# EAGLE board joyre_v1_1 (EAGLE 9.3.1), part 1 of 2
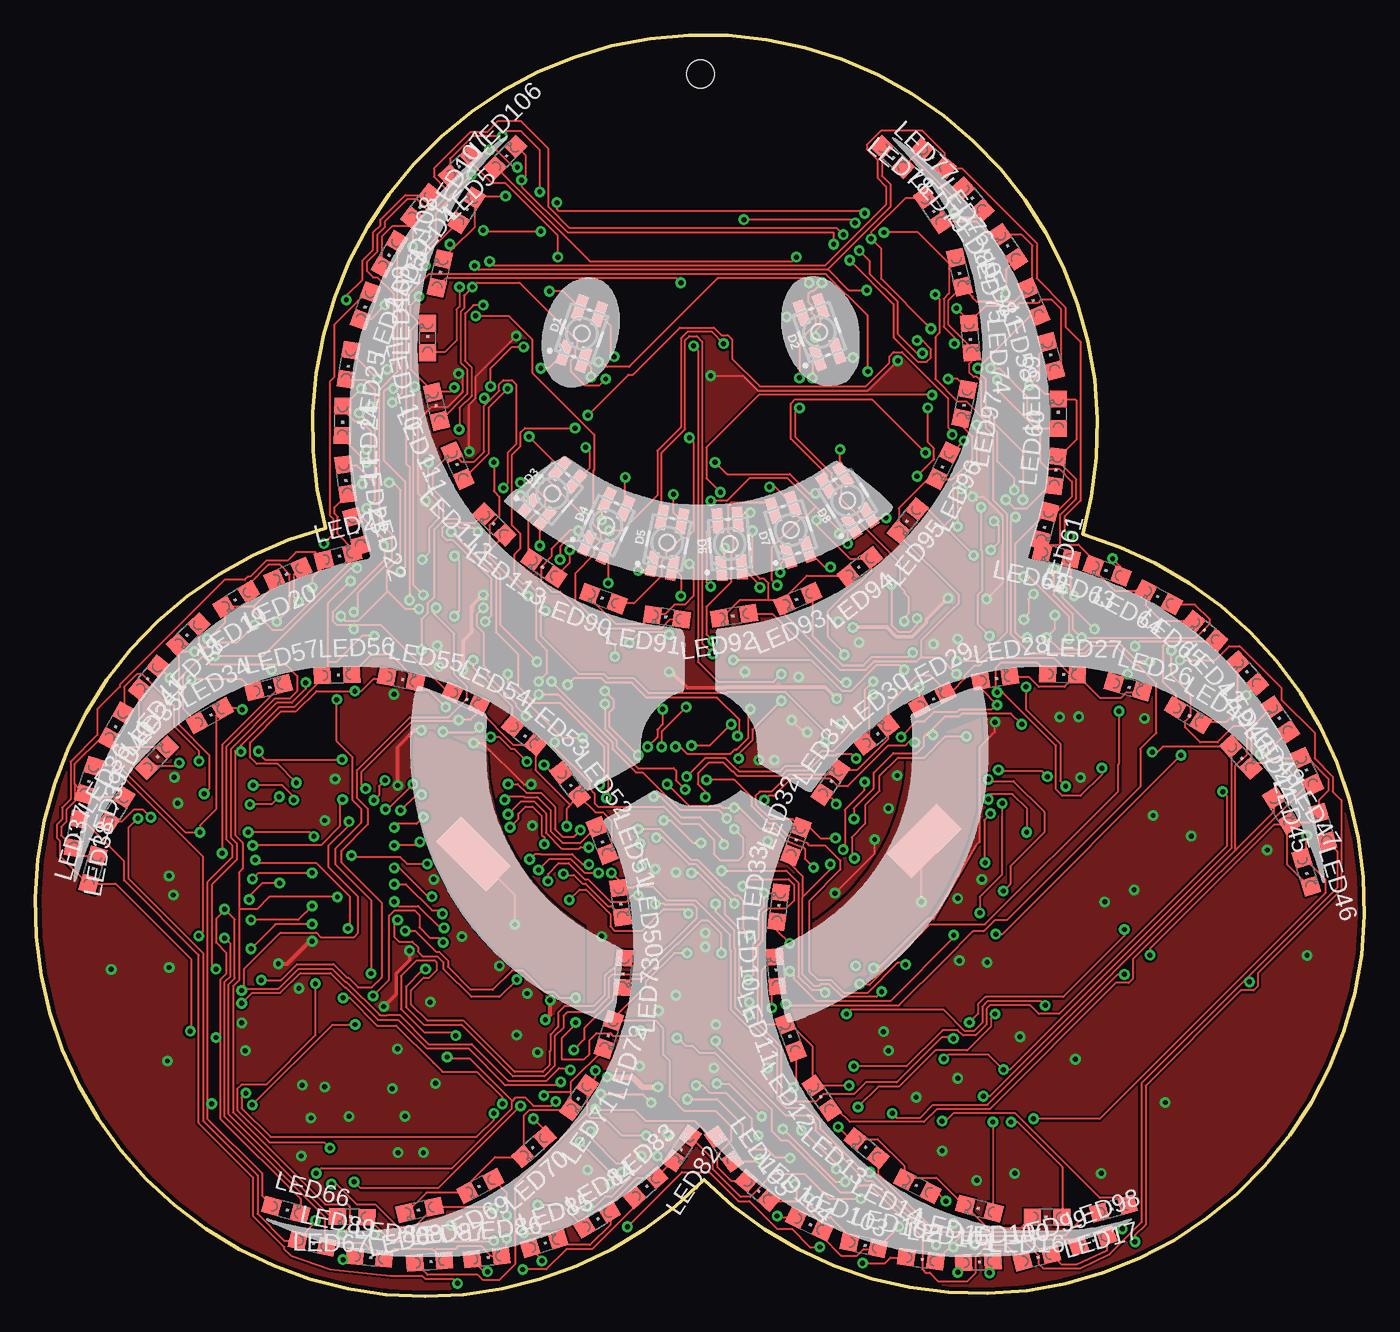
[diagram p1: board, top side]
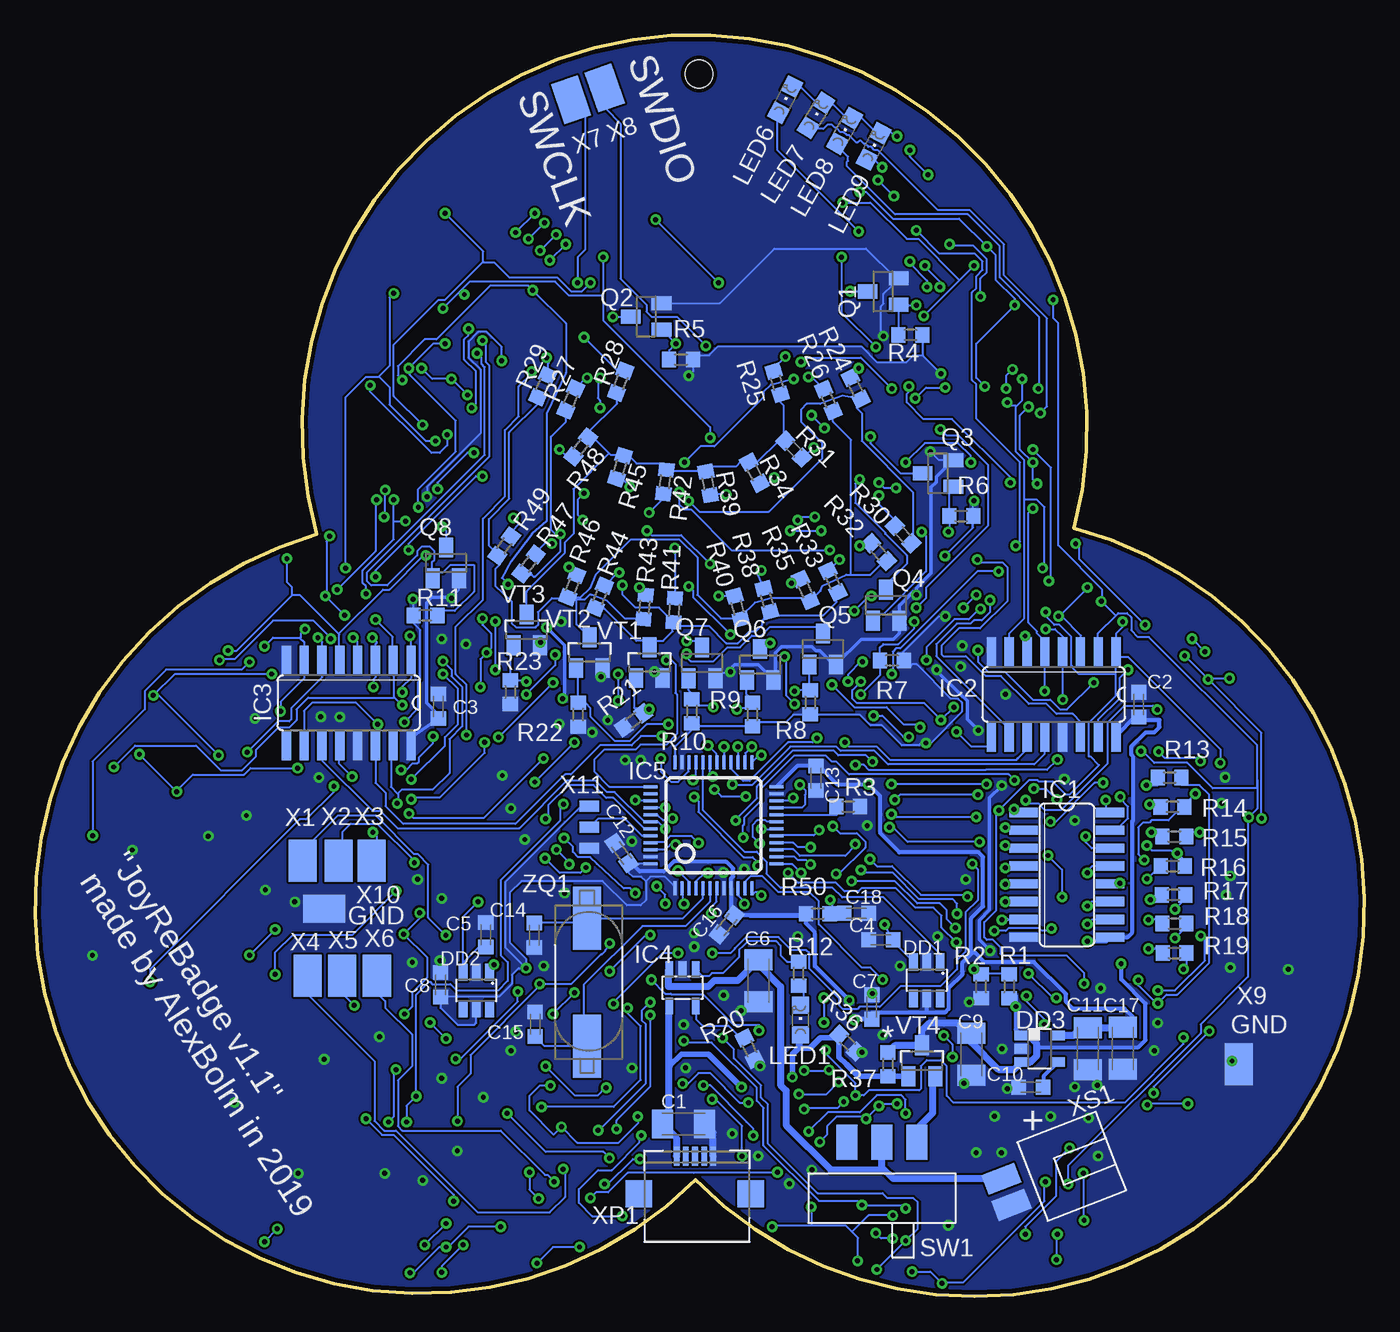
[diagram p2: board, bottom side, seen from below]

Size 94.79 x 89.91 mm. Coordinates in mm from the lower left corner, seen from the top.
Outline: 74.7,54.31 arc211 20.71,54.77 arc211 47.7,8.31 arc209 74.7,54.31
Copper layers (1*16): Top 0.035mm / dielectric 1.5mm / Bottom 0.035mm
Design rules "default *": minimum track width 6mil, minimum drill 0.35mm, track to track 6mil, track to pad 6mil, pad to pad 6mil, via to via 6mil, smd to smd 0mil, copper to edge 0.3mm, drill to drill 6mil, minimum pad ring 10mil, minimum via ring 8mil, stop-mask expansion 4mil, vias tented up to drill 15mil, thermal gap 10mil
Holes 2 mm at 47.45,87.14

## Footprints (pad centres in the part's own frame; a part is rotated, then mirrored left to right if it is on the bottom)
C1206K = smd 1.5 x 2: 1 -1.5,0; 2 1.5,0
C0603K = smd 1.05 x 1.08: 1 -0.875,0; 2 0.875,0
P-LCC-4-3 = smd 1.8 x 0.75: 1 -1.7,0.725; 2 -1.7,-0.725; 3 1.7,-0.725; 4 1.7,0.725
TSOT23-6 = smd 0.62 x 1.22: 1 -0.95,-1.3; 2 0,-1.3; 3 0.95,-1.3; 4 0.95,1.3; 5 0,1.3; 6 -0.95,1.3
DBV_R-PDSO-G5 = smd 0.69 x 0.99: 1 -0.95,-1.29; 2 0,-1.29; 3 0.95,-1.29; 4 0.95,1.3; 5 -0.95,1.3
SO16 = smd 0.66 x 2.032: 1 -4.445,-3.073; 2 -3.175,-3.073; 3 -1.905,-3.073; 4 -0.635,-3.073; 5 0.635,-3.073; 6 1.905,-3.073; 7 3.175,-3.073; 8 4.445,-3.073; 9 4.445,3.073; 10 3.175,3.073; 11 1.905,3.073; 12 0.635,3.073; 13 -0.635,3.073; 14 -1.905,3.073; 15 -3.175,3.073; 16 -4.445,3.073
SOT23-5L = smd 0.55 x 1.2: 1 -0.95,-1.3; 2 0,-1.3; 3 0.95,-1.3; 4 0.95,1.3; 5 -0.95,1.3
TQFP48 = smd 0.2 x 1: 1 -2.75,-4.5; 2 -2.25,-4.5; 3 -1.75,-4.5; 4 -1.25,-4.5; 5 -0.75,-4.5; 6 -0.25,-4.5; 7 0.25,-4.5; 8 0.75,-4.5; 9 1.25,-4.5; 10 1.75,-4.5; 11 2.25,-4.5; 12 2.75,-4.5; 25 2.75,4.5; 26 2.25,4.5; 27 1.75,4.5; 28 1.25,4.5; 29 0.75,4.5; 30 0.25,4.5; 31 -0.25,4.5; 32 -0.75,4.5; 33 -1.25,4.5; 34 -1.75,4.5; 35 -2.25,4.5; 36 -2.75,4.5 | smd 1 x 0.2: 13 4.5,-2.75; 14 4.5,-2.25; 15 4.5,-1.75; 16 4.5,-1.25; 17 4.5,-0.75; 18 4.5,-0.25; 19 4.5,0.25; 20 4.5,0.75; 21 4.5,1.25; 22 4.5,1.75; 23 4.5,2.25; 24 4.5,2.75; 37 -4.5,2.75; 38 -4.5,2.25; 39 -4.5,1.75; 40 -4.5,1.25; 41 -4.5,0.75; 42 -4.5,0.25; 43 -4.5,-0.25; 44 -4.5,-0.75; 45 -4.5,-1.25; 46 -4.5,-1.75; 47 -4.5,-2.25; 48 -4.5,-2.75
CHIPLED_0805 = smd 1.2 x 1.2: A 0,-1.05; C 0,1.05
SOT23 = smd 1 x 1.4: 1 -0.95,-1.1; 2 0.95,-1.1; 3 0,1.1
R0603 = smd 1 x 1.1: 1 -0.85,0; 2 0.85,0
SS12D00G3 = smd 1.5 x 2.5: 1 0,-1.25; 2 2.5,-1.25; 3 5,-1.25
1PIN_SMD_3X2 = smd 2 x 3: P$1 0,0
3PIN_SOLDER = smd 0.8 x 1.4: 1 0,0; 2 1.5,0; 3 3,0
CAP_PIN = smd 5 x 2.5: P$1 0,0
USB_MICR_SMD = smd 0.4 x 1.35: P$1 0,0; P$2 0.65,0; P$3 1.3,0; P$4 1.95,0; P$5 2.6,0 | smd 1.9 x 1.9: P$6 -2.715,-2.67; P$7 5.285,-2.67
CWF-2R = smd 1.5 x 2.5: P$1 0,-2; P$2 2,-2
HC49SM = smd 4.5 x 2: 1 0,0; 2 9.1,0

## Placement (x,y rotation side)
C1  10u  [C1206K]  48.55,12.3 0 bottom
C2  0.1u  [C0603K]  16.1,42.19 90 bottom
C3  0.1u  [C0603K]  66.03,42.07 90 bottom
C4  [C0603K]  34.47,25.42 0 bottom
C5  [C0603K]  62.65,25.79 270 bottom
C6  10u  [C1206K]  43.2,22.51 270 bottom
C7  0.1u  [C0603K]  35.13,20.64 270 bottom
C8  0.1u  [C0603K]  65.88,22.22 270 bottom
C9  10u  [C1206K]  28.03,17.26 270 bottom
C10  0.1u  [C0603K]  23.79,14.91 180 bottom
C11  10u  [C1206K]  19.73,17.67 270 bottom
C12  0.1u  [C0603K]  52.97,31.61 125 bottom
C13  0.1u  [C0603K]  39.1,36.94 270 bottom
C14  22p  [C0603K]  59.19,25.75 270 bottom
C15  22p  [C0603K]  59.13,19.4 90 bottom
C16  0.1u  [C0603K]  45.48,26.51 231 bottom
C17  10u  [C1206K]  17.23,17.68 270 bottom
C18  0.1u  [C0603K]  36.22,27.32 0 bottom
D1  RGB  [P-LCC-4-3]  38.98,68.64 71 top
D2  RGB  [P-LCC-4-3]  55.93,68.74 109.8 top
D3  RGB  [P-LCC-4-3]  36.88,57.24 50.2 top
D4  RGB  [P-LCC-4-3]  40.73,54.94 65.1 top
D5  RGB  [P-LCC-4-3]  45.08,53.74 78.5 top
D6  RGB  [P-LCC-4-3]  49.53,53.64 94.4 top
D7  RGB  [P-LCC-4-3]  53.88,54.64 108 top
D8  RGB  [P-LCC-4-3]  57.93,56.74 122.4 top
DD1  TTP223-BA6  [TSOT23-6]  31.21,22.54 180 bottom
DD2  TTP223-BA6  [TSOT23-6]  63.33,21.82 180 bottom
DD3  TPS79333  [DBV_R-PDSO-G5]  23.16,17.66 270 bottom
IC1  ULN2003AD  [SO16]  21.22,30.05 270 bottom
IC2  74HC595D  [SO16]  22.16,42.91 180 bottom
IC3  74HC595D  [SO16]  72.43,42.31 180 bottom
IC4  MCP73831/OT  [SOT23-5L]  48.62,22 180 bottom
IC5  STM32F10XCXT6  [TQFP48]  46.42,33.59 0 bottom
LED1  [CHIPLED_0805]  40.21,19.72 0 bottom
LED2  [CHIPLED_0805]  23.57,70.61 160.2 top
LED3  [CHIPLED_0805]  25.29,74.31 150 top
LED4  [CHIPLED_0805]  27.51,77.71 141.7 top
LED5  [CHIPLED_0805]  30.33,80.61 133.7 top
LED6  [CHIPLED_0805]  41.3,85.31 332.8 bottom
LED7  [CHIPLED_0805]  39.1,84.2 327.9 bottom
LED8  [CHIPLED_0805]  37.07,83.09 330.3 bottom
LED9  [CHIPLED_0805]  34.99,81.98 332.9 bottom
LED10  [CHIPLED_0805]  52.85,23.16 4.6 top
LED11  [CHIPLED_0805]  53.87,18.46 21.2 top
LED12  [CHIPLED_0805]  56.09,14.16 34.8 top
LED13  [CHIPLED_0805]  59.31,10.56 50.9 top
LED14  [CHIPLED_0805]  62.93,7.86 63.3 top
LED15  [CHIPLED_0805]  67.35,6.26 75.4 top
LED16  [CHIPLED_0805]  72.17,5.66 89.8 top
LED17  [CHIPLED_0805]  76.89,6.26 105.5 top
LED18  [CHIPLED_0805]  10.93,47.2 133.6 top
LED19  [CHIPLED_0805]  14.35,49.7 121.3 top
LED20  [CHIPLED_0805]  18.03,51.52 113.8 top
LED21  [CHIPLED_0805]  21.61,52.75 284.2 top
LED22  [CHIPLED_0805]  22.93,54.55 196.3 top
LED23  [CHIPLED_0805]  22.15,58.25 187.9 top
LED24  [CHIPLED_0805]  21.93,62.41 179.2 top
LED25  [CHIPLED_0805]  22.35,66.41 170.7 top
LED26  [CHIPLED_0805]  77.93,43.44 253.5 top
LED27  [CHIPLED_0805]  73.25,44.34 268.2 top
LED28  [CHIPLED_0805]  68.47,44.04 279.2 top
LED29  [CHIPLED_0805]  63.99,42.54 298.4 top
LED30  [CHIPLED_0805]  60.01,40.04 308.1 top
LED31  [CHIPLED_0805]  56.73,36.64 325.5 top
LED32  [CHIPLED_0805]  54.25,32.44 339.3 top
LED33  [CHIPLED_0805]  53.03,27.76 352.7 top
LED34  [CHIPLED_0805]  12.47,41.4 299.3 top
LED35  [CHIPLED_0805]  8.69,38.4 315.8 top
LED36  [CHIPLED_0805]  5.81,34.7 328.2 top
LED37  [CHIPLED_0805]  4.13,30.4 343.7 top
LED38  [CHIPLED_0805]  2.95,33 169.5 top
LED39  [CHIPLED_0805]  3.87,36.8 161.6 top
LED40  [CHIPLED_0805]  5.79,40.7 150.6 top
LED41  [CHIPLED_0805]  8.11,44.1 141.6 top
LED42  [CHIPLED_0805]  86.47,44.44 42 top
LED43  [CHIPLED_0805]  88.79,41.14 33.6 top
LED44  [CHIPLED_0805]  90.71,37.44 24.6 top
LED45  [CHIPLED_0805]  91.83,33.44 16.3 top
LED46  [CHIPLED_0805]  90.65,30.24 197.8 top
LED47  [CHIPLED_0805]  88.87,34.64 211.8 top
LED48  [CHIPLED_0805]  85.99,38.44 222.2 top
LED49  [CHIPLED_0805]  82.21,41.44 239 top
LED50  [CHIPLED_0805]  41.75,28.08 187.4 top
LED51  [CHIPLED_0805]  40.43,32.5 201.5 top
LED52  [CHIPLED_0805]  38.15,36.5 217.9 top
LED53  [CHIPLED_0805]  34.87,40 230.7 top
LED54  [CHIPLED_0805]  30.69,42.6 244.5 top
LED55  [CHIPLED_0805]  26.11,44 259.1 top
LED56  [CHIPLED_0805]  21.53,44.3 272.1 top
LED57  [CHIPLED_0805]  16.65,43.4 284.2 top
LED58  [CHIPLED_0805]  72.45,67.02 15.2 top
LED59  [CHIPLED_0805]  72.97,62.92 0 top
LED60  [CHIPLED_0805]  72.79,58.82 352.9 top
LED61  [CHIPLED_0805]  72.01,54.92 164.4 top
LED62  [CHIPLED_0805]  72.83,52.82 77.2 top
LED63  [CHIPLED_0805]  76.45,51.72 69.6 top
LED64  [CHIPLED_0805]  80.13,49.84 62.3 top
LED65  [CHIPLED_0805]  83.45,47.44 50.3 top
LED66  [CHIPLED_0805]  17.89,6.18 254.9 top
LED67  [CHIPLED_0805]  22.61,5.68 88.3 top
LED68  [CHIPLED_0805]  27.43,6.18 102.5 top
LED69  [CHIPLED_0805]  31.75,7.88 117.2 top
LED70  [CHIPLED_0805]  35.57,10.68 131.2 top
LED71  [CHIPLED_0805]  38.79,14.18 145.2 top
LED72  [CHIPLED_0805]  40.91,18.68 161.6 top
LED73  [CHIPLED_0805]  41.93,23.08 175.9 top
LED74  [CHIPLED_0805]  66.69,68.32 184.9 top
LED75  [CHIPLED_0805]  65.91,73.02 193.4 top
LED76  [CHIPLED_0805]  64.03,77.42 214.4 top
LED77  [CHIPLED_0805]  61.15,81.22 226.1 top
LED78  [CHIPLED_0805]  64.07,81.12 51.2 top
LED79  [CHIPLED_0805]  66.89,78.22 41.4 top
LED80  [CHIPLED_0805]  69.41,74.82 33.8 top
LED81  [CHIPLED_0805]  71.2,70.9 23.2 top
LED82  [CHIPLED_0805]  46.13,10.56 146.4 top
LED83  [CHIPLED_0805]  43.55,7.78 311.9 top
LED84  [CHIPLED_0805]  40.07,5.48 301.5 top
LED85  [CHIPLED_0805]  36.29,3.78 287.3 top
LED86  [CHIPLED_0805]  32.21,2.78 276.4 top
LED87  [CHIPLED_0805]  28.13,2.48 274.7 top
LED88  [CHIPLED_0805]  23.85,2.78 265 top
LED89  [CHIPLED_0805]  19.77,3.78 257.9 top
LED90  [CHIPLED_0805]  40.53,49.74 69.7 top
LED91  [CHIPLED_0805]  45.07,48.43 81.7 top
LED92  [CHIPLED_0805]  49.85,48.52 98.9 top
LED93  [CHIPLED_0805]  54.39,49.73 113.5 top
LED94  [CHIPLED_0805]  58.81,52.03 127.8 top
LED95  [CHIPLED_0805]  62.23,55.32 141.1 top
LED96  [CHIPLED_0805]  64.75,59.22 153.5 top
LED97  [CHIPLED_0805]  66.27,63.62 168.4 top
LED98  [CHIPLED_0805]  75.41,3.96 289.5 top
LED99  [CHIPLED_0805]  71.43,2.76 284 top
LED100  [CHIPLED_0805]  67.25,2.46 272.5 top
LED101  [CHIPLED_0805]  63.17,2.66 262.1 top
LED102  [CHIPLED_0805]  59.09,3.66 258.2 top
LED103  [CHIPLED_0805]  55.21,5.16 245 top
LED104  [CHIPLED_0805]  51.53,7.56 228.8 top
LED105  [CHIPLED_0805]  49.14,10.51 214.4 top
LED106  [CHIPLED_0805]  33.54,81.22 315.4 top
LED107  [CHIPLED_0805]  30.76,77.42 327.7 top
LED108  [CHIPLED_0805]  28.88,72.92 347.3 top
LED109  [CHIPLED_0805]  28,68.32 0 top
LED110  [CHIPLED_0805]  28.62,63.42 13.3 top
LED111  [CHIPLED_0805]  30.14,59.22 23.8 top
LED112  [CHIPLED_0805]  32.76,55.02 45 top
LED113  [CHIPLED_0805]  36.28,51.92 55.7 top
Q1  BSS84  [SOT23]  34.32,71.63 90 bottom
Q2  BSS84  [SOT23]  51.22,69.84 90 bottom
Q3  BSS84  [SOT23]  30.41,58.67 90 bottom
Q4  BSS84  [SOT23]  34.11,49.27 0 bottom
Q5  BSS84  [SOT23]  38.62,46.15 0 bottom
Q6  BSS84  [SOT23]  43.09,45.04 0 bottom
Q7  BSS84  [SOT23]  47.23,45.16 0 bottom
Q8  BSS84  [SOT23]  65.49,52.29 0 bottom
R1  47k  [R0603]  25.32,22.11 90 bottom
R2  47k  [R0603]  27.34,22.11 270 bottom
R3  10k  [R0603]  36.81,34.91 0 bottom
R4  10k  [R0603]  32.36,68.54 180 bottom
R5  10k  [R0603]  48.73,66.78 180 bottom
R6  10k  [R0603]  28.75,55.63 180 bottom
R7  10k  [R0603]  33.69,45.34 180 bottom
R8  10k  [R0603]  39.51,42.35 90 bottom
R9  10k  [R0603]  43.63,41.48 90 bottom
R10  10k  [R0603]  47.95,41.71 90 bottom
R11  10k  [R0603]  66.95,48.55 0 bottom
R12  1k  [R0603]  40.35,23.01 90 bottom
R13  330  [R0603]  13.89,36.98 0 bottom
R14  330  [R0603]  13.68,34.9 0 bottom
R15  330  [R0603]  13.55,32.78 0 bottom
R16  330  [R0603]  13.66,30.68 0 bottom
R17  330  [R0603]  13.6,28.62 0 bottom
R18  330  [R0603]  13.54,26.58 0 bottom
R19  330  [R0603]  13.53,24.48 0 bottom
R20  4.7k  [R0603]  43.85,17.66 115.9 bottom
R21  10k  [R0603]  52.12,41.06 216.2 bottom
R22  10k  [R0603]  56.06,41.47 270 bottom
R23  10k  [R0603]  60.89,43.08 270 bottom
R24  470  [R0603]  36.27,64.73 115.9 bottom
R25  330  [R0603]  41.88,65.13 106.9 bottom
R26  680  [R0603]  38.22,63.89 113.2 bottom
R27  470  [R0603]  56.6,63.94 66 bottom
R28  330  [R0603]  53.03,65.19 69.3 bottom
R29  680  [R0603]  58.6,64.88 65.7 bottom
R30  470  [R0603]  32.9,54.3 133.9 bottom
R31  330  [R0603]  40.7,60.4 315 bottom
R32  680  [R0603]  34.62,53.05 132.4 bottom
R33  470  [R0603]  37.9,50.96 115.2 bottom
R34  330  [R0603]  43.5,58.72 298 bottom
R35  680  [R0603]  39.86,50.35 114.4 bottom
R36  10k  [R0603]  36.85,18.06 315 bottom
R37  0*  [R0603]  33.98,16.54 270 bottom
R38  470  [R0603]  42.6,49.64 105.6 bottom
R39  330  [R0603]  46.8,57.96 280.7 bottom
R40  680  [R0603]  44.7,49.1 105.3 bottom
R41  470  [R0603]  49.22,48.91 86.9 bottom
R42  330  [R0603]  49.88,58.07 262.7 bottom
R43  680  [R0603]  51.33,49.15 84.3 bottom
R44  470  [R0603]  54.52,49.87 67.9 bottom
R45  330  [R0603]  53.08,59.11 252.6 bottom
R46  680  [R0603]  56.48,50.63 68 bottom
R47  470  [R0603]  59.59,52.21 52.7 bottom
R48  330  [R0603]  55.88,60.55 232.2 bottom
R49  680  [R0603]  61.34,53.49 54.6 bottom
R50  10k  [R0603]  38.98,27.28 180 bottom
SW1  SS12D00G3  [SS12D00G3]  31.9,9.75 180 bottom
VT1  AO3400A  [SOT23]  50.99,45.17 0 bottom
VT2  AO3400A  [SOT23]  55.26,45.89 0 bottom
VT3  AO3400A  [SOT23]  59.73,47.52 0 bottom
VT4  AO3401  [SOT23]  31.55,16.8 0 bottom
X1  PB0  [1PIN_SMD_3X2]  75.71,31.05 180 bottom
X2  PB4  [1PIN_SMD_3X2]  73.14,31.05 0 bottom
X3  PB3  [1PIN_SMD_3X2]  70.77,31.05 0 bottom
X4  PC15  [1PIN_SMD_3X2]  75.36,22.85 0 bottom
X5  PC14  [1PIN_SMD_3X2]  72.9,22.85 0 bottom
X6  PC13  [1PIN_SMD_3X2]  70.42,22.85 0 bottom
X7  SWCLK  [1PIN_SMD_3X2]  56.58,85.31 198.4 bottom
X8  SWDIO  [1PIN_SMD_3X2]  54.16,86.15 199.1 bottom
X9  PB0  [1PIN_SMD_3X2]  8.95,16.54 0 bottom
X10  PB0  [1PIN_SMD_3X2]  74.17,27.64 90 bottom
X11  BOOT0  [3PIN_SOLDER]  55.27,34.95 270 bottom
XC1  CAP_PIN  [CAP_PIN]  31.26,31.54 135 top
XC2  CAP_PIN  [CAP_PIN]  63.38,32.47 225 top
XP1  USB_MICR_SMD  [USB_MICR_SMD]  49.04,9.99 0 bottom
XS1  MW-02MR  [CWF-2R]  24.03,9.12 291.2 bottom
ZQ1  8MHz  [HC49SM]  55.42,17.85 90 bottom

## Tracks (layer width: path | path; a pad name or v marks a point on that pad's centre or on a via)
5V_USB  (via drill 0.35)
  Top 0.4: v40.79,15.64 42.61,15.64 43.32,14.93 v44.42,14.93
  Bottom 0.152: 40.79,17.28 40.79,17.47 40.48,17.77 40.48,18.69 40.26,18.69 LED1.A | 33.88,15.7 VT4.1 | 36.93,16.55 36.08,15.69 R37.2
  Bottom 0.4: v40.79,15.64 40.79,17.28 40.26,17.81 | 40.26,17.81 40.26,18.69 | 40.26,17.81 40.12,17.68 39.52,17.68 38.78,18.43 37.68,18.43 R36.1 37.45,17.06 36.93,16.55 36.09,15.7 33.88,15.7 | VT4.1 32.51,15.69 R37.2 | v44.42,14.93 46.76,17.27 48.71,17.27 49.58,16.41
  Bottom 0.5: XP1.P$1 49.07,10.02 49.07,11.31 C1.1 49.58,12.77 49.58,16.41 IC4.4
+3V3  (via drill 0.35)
  Top 0.152: v68.45,40.94 68.45,40.25 67.35,39.15 67.35,32.42 67.07,32.15 64.06,26.92 63.67,26.92 60.15,23.4 v59.78,23.4 | v29.89,48.48 30.23,48.82 30.23,52.48 v29.92,52.79 | v30.2,65.78 30.5,65.48 30.5,64.48 29.43,63.42 28.29,63.42 27.3,62.43 27.3,57.25 v27.83,56.71 | v67.84,49.7 68.98,50.84 68.98,55.65 67.61,57.02 v66.85,57.02 | v61.52,66.69 59.38,64.56 51.53,64.56 50.47,65.63 v48.18,65.63 | v35.38,36.51 34.86,36.51 31.91,39.45 v31.27,39.45
  Top 0.3: v36.38,19.72 36.73,20.08 v36.73,21.11
  Bottom 0.152: R50.2 39.72,26.99 39.77,26.99 39.85,27.07 43.84,27.07 43.95,27.19 44.7,27.19 C16.1 45.17,27.42 | 38.91,37.81 39.04,37.81 C13.1 | 36.22,19.89 35.46,19.89 | 35.58,19.77 C7.2 | v68.45,40.94 67.46,41.93 67.46,43.83 67.32,43.97 67.32,47.51 67.84,48.03 67.84,48.48 R11.1 67.84,48.56 v67.84,49.7 | R4.1 31.49,68.52 31.49,67.08 31.47,67.05 | IC5.36 49.17,38.12 49.17,39.2 47.89,40.48 47.91,40.82 R10.1 47.73,40.63 R9.1 43.32,40.94 41.24,40.94 40.71,41.47 39.57,41.47 R8.1 39.49,41.47 35.98,41.47 35.21,40.7 34.41,40.7 32.99,39.28 31.75,39.28 31.58,39.45 v31.27,39.45 30.92,39.45 28.67,41.7 28.67,42.31 28.98,42.62 29.48,42.62 31.92,45.05 32.25,45.05 32.41,44.9 32.86,44.9 32.86,45.28 R7.1 32.86,45.36 32.86,45.97 30.35,48.48 v29.89,48.48 | v29.92,52.79 27.91,54.8 27.91,55.57 R6.1 27.91,55.65 27.91,56.64 v27.83,56.71 | v30.2,65.78 31.47,67.05 | v66.85,57.02 66.85,57.7 63.04,61.51 63.04,66.08 63.88,66.92 63.88,68.07 63.19,68.75 62.58,68.75 61.52,67.69 v61.52,66.69 | v48.18,65.63 47.88,65.93 R5.1 47.88,66.85 47.88,67.08 46.73,67.08 46.09,67.72 35.88,67.72 34.74,66.58 32.67,66.58 32.2,67.05 31.47,67.05 | X11.1 55.85,34.94 61.26,29.53 61.26,24.89 v59.79,23.41 | IC5.48 52.22,30.84 52.46,30.84 | v59.79,23.41 v59.78,23.4 60.31,23.4 60.78,22.93 60.78,22.3 61.7,21.38 65.64,21.38 65.66,21.36 65.86,21.36 C8.2 65.88,20.58 64.68,19.38 63.44,19.38 63.33,19.5 DD2.5 | IC5.1 49.24,29.27 49.89,29.92 50.91,29.92 51.24,29.59 | 51.24,29.59 51.24,28.26 51.61,27.89 52.59,27.89 54.32,29.61 60.12,29.61 60.94,28.78 60.94,25.24 59.79,24.09 v59.79,23.41 | 52.46,30.84 52.46,30.22 52.16,29.92 51.57,29.92 51.24,29.59
  Bottom 0.152: C12.1 52.46,30.88 52.46,30.84
  Bottom 0.3: C17.1 16.92,19.5 16.71,19.5 16.71,19.62 16.53,19.81 16.53,19.93 17.11,20.51 20.78,20.51 21.29,21.01 21.29,21.56 23.56,23.84 27.1,23.84 27.75,24.49 28.06,24.49 | 35.58,19.77 35.46,19.89 35.1,20.24 31.26,20.24 | 31.26,20.24 29.91,20.24 29.65,20.51 29.65,21.97 28.67,22.94 28.67,23.16 28.67,23.17 28.67,23.79 28.06,24.4 28.06,24.49 | 31.26,20.24 31.21,20.29 DD1.5 | C7.2 36.34,19.77 | 36.22,19.89 36.34,19.77 | 36.34,19.77 v36.38,19.72 | v36.73,21.11 39.2,23.57 39.2,25.97 39.83,26.61 R50.2 39.92,27.19 44.7,27.19 | 45.17,27.42 IC5.9 45.17,29.8 45.02,29.94 45.02,30.51 45.5,30.99 48.62,30.99 48.66,31.03 49.22,31.03 49.96,30.3 51.68,30.3 52.22,30.84 | 38.91,37.81 37.6,36.51 v35.38,36.51 34.55,35.68 34.55,33.04 33.16,31.66 27.51,31.66 27.19,31.34 27.19,27.81 28.06,26.95 28.06,24.49 | C13.1 40.44,37.82 IC5.24
  Bottom 0.5: DD3.5 20.75,18.61 20.19,19.17 C11.1 17.25,19.17 C17.1
  pour Top (rank 6, no thermals): -20.89,112.47 119.92,112.47 119.92,-14.65 119.92,-18.35 -22.37,-18.35 -22.37,112.47
  pour Bottom (rank 6, no thermals): -24.84,113.58 122.14,113.58 122.14,-25.26 -24.84,-25.26
ANRGB1  (via drill 0.35)
  Top 0.152: v36.67,71.65 37.66,71.65 38.81,70.5 D1.4
  Bottom 0.152: v36.67,71.65 35.45,71.65 Q1.3
ANRGB2  (via drill 0.35)
  Top 0.152: v53.59,69.82 54.43,69.82 54.66,70.05 D2.4
  Bottom 0.152: v53.59,69.82 52.37,69.82 Q2.3
ANRGB3  (via drill 0.35)
  Top 0.152: v35.23,61.28 37.44,59.07 D3.4
  Bottom 0.152: v35.23,61.28 35.23,60.83 33.09,58.69 31.57,58.69 Q3.3
ANRGB4  (via drill 0.35)
  Top 0.152: v35.99,58.24 36.52,58.24 v39.19,55.57 | v40.41,55.34 40.41,56.41 40.71,56.71 D4.4
  Bottom 0.152: v35.99,58.24 36.29,57.93 36.29,56.56 34.16,54.43 34.16,54.35 32.64,52.83 32.64,52.22 33.93,50.92 34.08,50.92 34.08,50.39 Q4.3 | v39.19,55.57 40.18,55.57 v40.41,55.34
ANRGB5  (via drill 0.35)
  Top 0.152: v48.33,45.82 47.57,46.58 47.57,68.07 47.19,68.45 46.66,68.45 46.35,68.14 46.35,61.82 44.67,60.14 44.67,55.57 D5.4
  Bottom 0.152: v48.33,45.82 48.33,45.57 48.05,45.28 46.41,45.28 45.42,46.27 44.52,46.27 43.68,47.11 43,47.11 42.39,47.72 38.66,47.72 38.66,47.26 Q5.3
ANRGB6  (via drill 0.35)
  Top 0.152: v42.38,46.58 43.14,47.34 45.06,47.34 v45.21,47.19 | v48.18,50.62 47.88,50.92 47.88,54.5 48.64,55.26 D6.4
  Bottom 0.152: v42.38,46.58 43.07,46.58 43.07,46.2 Q6.3 | v45.21,47.19 47.88,49.85 47.88,50.31 v48.18,50.62
ANRGB7  (via drill 0.35)
  Top 0.152: v48.33,46.73 47.88,47.19 47.88,49.17 49.63,50.92 49.63,52.9 49.78,53.05 49.78,54.12 49.4,54.5 49.4,56.33 49.63,56.56 52.14,56.56 52.6,56.1 D7.4
  Bottom 0.152: v48.33,46.73 47.27,46.73 47.27,46.27 Q7.3
ANRGB8  (via drill 0.35)
  Top 0.152: v65.78,54.88 65.78,57.25 v66.09,57.55 | v63.5,60.14 59.69,63.95 54.2,63.95 53.9,63.65 53.9,61.13 56.49,58.54 56.49,57.93 56.41,57.86 D8.4
  Bottom 0.152: v65.78,54.88 65.48,54.58 65.48,53.44 Q8.3 | v66.09,57.55 66.09,58.01 63.95,60.14 v63.5,60.14
ARGB1  (via drill 0.35)
  Top 0.152: v47.48,32.34 46.9,32.34 45.31,33.93 v44.83,33.93 | v35.07,38.12 34.16,39.03 33.93,39.03 33.07,39.89 v32.49,39.89 | v35,41.4 34.31,42.08 34.31,42.23 32.25,44.29 32.25,44.67 31.97,44.96 31.97,47.32 31.49,47.8 31.49,48.64 v31.95,49.09 | v30.23,61.81 30.26,61.84 30.26,63.33 31.11,64.18 31.11,66.24 30.65,66.69 30.65,70.05 31.26,70.66 v31.95,70.66
  Bottom 0.152: v35.07,38.12 35.53,38.58 37.51,38.58 37.82,38.88 40.79,38.88 43.3,36.37 43.3,35.53 44.83,34 v44.83,33.93 | v32.49,39.89 32.87,39.89 34.38,41.4 v35,41.4 | v30.23,61.81 29.8,61.38 28.95,61.38 26.84,59.27 26.84,54.94 31.24,50.55 31.24,49.81 v31.95,49.09 | v31.95,70.66 33.17,70.66 Q1.1 33.24,70.73 33.32,70.66 33.24,70.58 33.24,68.6 R4.2 | v47.48,32.34 47.97,32.82 48.86,32.82 48.87,32.82 49.5,32.82 49.93,32.39 50.87,32.39 IC5.45
ARGB2  (via drill 0.35)
  Top 0.152: v44.11,35.64 44.56,35.64 46.04,34.16 47.4,34.16 47.42,34.17 49.12,32.47 v49.12,32.21 | v40.64,42.23 40.64,40.48 41.47,39.64 41.47,39.19 43,37.66 45.53,37.66 45.69,37.5 45.69,36.8 v46.35,36.14 | v41.34,45.61 41.34,46.33 37.44,50.24 36.83,50.24 36.06,51 36.06,51.99 36.83,52.75 36.83,53.28 38.16,54.61 38.7,54.61 v38.73,54.58 | v40.94,54.58 41.86,54.58 44.37,57.09 44.37,60.29 46.05,61.97 46.05,68.29 46.5,68.75 48.26,68.75 v49.09,67.91
  Bottom 0.152: v49.12,32.21 49.49,32.21 49.83,31.87 50.85,31.87 IC5.46 | v44.11,35.64 45.85,35.64 v46.35,36.14 | v40.64,42.23 41.25,42.84 41.25,45.52 v41.34,45.61 | v40.94,54.58 v38.73,54.58 | R5.2 49.55,66.85 49.55,67.46 v49.09,67.91 49.08,67.93 50.06,68.9 50.09,68.9 Q2.1
ARGB3  (via drill 0.35)
  Top 0.152: v40.26,36.47 40.56,36.78 40.56,39.19 37.44,42.31 35.61,42.31 34.44,43.48 34.44,45.76 32.86,47.34 32.86,51.3 v29.66,54.5
  Bottom 0.152: v29.66,54.5 29.59,54.58 29.59,55.57 R6.2 29.59,55.65 29.59,57.7 29.36,57.7 Q3.1 | IC5.21 41.86,34.84 40.09,34.84 39.89,35.04 39.89,35.76 39.87,35.78 39.87,36.09 v40.26,36.47
ARGB4  (via drill 0.35)
  Top 0.152: v40.74,35.54 40.86,35.66 40.86,39.34 37.28,42.92 v35.91,42.92 | v31.57,54.5 31.26,54.81 30.27,54.81 29.97,55.11 29.36,55.11 29.05,54.81 29.05,54.2 29.36,53.89 29.82,53.89 32.56,51.15 32.56,48.56 v32.1,48.1
  Bottom 0.152: v35.91,42.92 34.54,44.29 34.54,45.28 R7.2 34.54,45.36 34.54,46.27 34.31,46.5 33.24,46.5 32.1,47.64 v32.1,48.1 | v31.57,54.5 31.26,54.2 31.26,51.68 34.31,48.64 35.07,48.64 35.07,48.18 Q4.1 | v40.74,35.54 40.94,35.34 IC5.22
ARGB5  (via drill 0.35)
  Top 0.152: v43,38.58 40.94,40.63 40.94,41.62 41.25,41.93 41.25,42.54 v40.64,43.15
  Bottom 0.152: v40.64,43.15 40.56,43.22 39.57,43.22 R8.2 39.57,43.3 39.57,44.98 Q5.1 | v43,38.58 43.18,38.58 IC5.25
ARGB6  (via drill 0.35)
  Top 0.152: v43.68,39.19 44.37,39.87 44.37,40.41 44.75,40.79 v44.75,41.85
  Bottom 0.152: v44.75,41.85 44.67,41.93 43.91,41.93 43.91,42.15 | IC5.26 44.14,38.12 44.14,38.73 v43.68,39.19 | 43.91,42.15 R9.2 | 43.91,42.15 43.91,42.77 44.07,42.92 44.07,43.91 Q6.1
ARGB7  (via drill 0.35)
  Top 0.152: v44.67,39.19 44.67,40.25 v46.43,42.01
  Bottom 0.152: v44.67,39.19 44.67,38.12 IC5.27 | v46.43,42.01 46.58,42.16 47.79,42.16 R10.2 47.8,42.62 47.8,42.84 48.18,43.22 48.18,43.99 Q7.1
ARGB8  (via drill 0.35)
  Top 0.152: v39.04,39.8 37.66,39.8 33.7,43.76 v33.7,44.37 | v26.08,51.68 26.39,51.99 26.39,58.08 24.86,59.61 24.86,64.48 25.09,64.71 v25.55,64.71 | v25.09,66.08 25.55,66.54 25.55,71.5 24.41,72.64 24.1,72.64 23.64,73.1 23.64,73.7 24.41,74.47 24.41,75.69 24.94,76.22 24.94,76.6 26.54,78.2 27.23,78.2 27.99,77.44 28.37,77.44 29.28,78.35 29.28,78.96 28.44,79.8 28.44,80.41 31.04,83 32.22,83 32.97,83.75 34.66,83.75 36.6,81.82 36.6,77.67 38.12,76.14 57.17,76.14 v57.63,75.69 | v58.77,74.54 59.53,73.78 59.53,72.87 61.52,70.89 61.52,68.6 62.89,67.23 v63.27,67.23
  Bottom 0.152: v39.04,39.8 39.34,39.49 41.09,39.49 43.84,36.75 44.29,36.75 45.13,37.59 45.13,38.04 IC5.28 | v33.7,44.37 33.47,44.6 33.63,44.75 33.63,45.97 33.4,46.2 33.09,46.2 27.61,51.68 v26.08,51.68 | v25.55,64.71 25.55,65.63 v25.09,66.08 | v58.77,74.54 v57.63,75.69 | v63.27,67.23 62.96,66.92 62.96,66.47 62.73,66.24 62.73,59.99 71.12,51.61 71.12,51 70.81,50.69 69.67,50.69 67.53,52.83 67.53,53.13 67.23,53.44 66.62,53.44 66.32,53.13 66.32,52.52 66.47,52.37 66.47,51.61 | 66.47,51.61 66.47,51.23 Q8.1 66.47,51.61 | 66.47,51.61 65.71,51.61 65.17,52.14 63.5,52.14 63.5,50.24 64.87,48.86 66.09,48.86 66.09,48.56 R11.2
B1
  Bottom 0.152: R25.1 41.7,64.26 41.7,63.8 41.44,63.54 41.44,61.14 R31.1 41.32,61.06 41.34,61.03 41.73,61.03 43.3,59.46 43.84,59.46 R34.1 43.91,59.53 44.45,59.53 44.83,59.15 46.8,59.15 46.95,59 R39.1 46.96,58.85 49.7,58.85 R42.1 49.77,59.1 50.04,59.38 51.91,59.38 52.45,59.91 52.75,59.91 R45.1 52.83,59.99 53.74,59.99 53.86,60.1 | 53.86,60.1 54.96,61.21 55.34,61.21 R48.1 55.34,61.28 55.34,61.59 53.29,63.65 53.29,64.33 R28.1 | 53.86,60.1 56.41,57.55 56.41,54.35 57.02,53.74 57.02,52.98 59.76,50.24 59.73,50.21 VT3.3
B_ON1  (via drill 0.35)
  Top 0.152: v46.46,37.05 47.75,38.35 49.25,38.35 49.86,37.74 49.88,37.74 50.19,37.44 53.11,37.44 53.49,37.81 55.06,37.81 56.12,38.88 56.94,38.88 59.15,41.09 59.15,43.22 v59.76,43.83
  Bottom 0.152: v46.46,37.05 46.66,37.25 46.66,38.04 IC5.31 | v59.76,43.83 59.84,43.91 60.68,43.91 | 60.68,43.91 60.83,43.91 R23.1 | 60.68,43.91 R23.1 | R23.1 60.89,46.21 VT3.1
BOOT1
  Bottom 0.152: IC5.20 41.86,34.31 37.64,34.31 37.64,34.91 R3.1
G1
  Bottom 0.152: 36.6,51.45 36.94,51.45 38.65,50.65 38.78,50.29 R35.1 39.55,49.93 39.65,49.93 39.8,49.78 42.33,49.78 43.47,49.46 44.45,48.48 44.45,48.33 R40.1 44.52,48.33 45.89,48.33 47.57,50.01 47.57,52.67 48.87,53.97 52.29,53.97 54.81,51.45 55.23,50.5 55.93,49.8 | 36.6,51.45 35.23,51.45 34.09,52.59 R32.1 | 36.6,51.45 36.6,61.06 37.89,62.35 37.89,63.04 R26.1 | 56.18,49.7 56.63,49.7 R46.1 | 56.18,49.7 56.03,49.7 | 56.03,49.7 55.57,49.7 55.27,50.01 55.12,50.01 54.02,49.59 52.75,48.33 51.46,48.33 R43.1 | 56.18,49.7 56.18,49.8 R46.1 | R29.1 58.92,64.1 58.92,63.65 60.97,61.6 60.97,56.87 62.43,55.42 62.43,53.51 61.79,52.87 R49.1 61.67,52.79 61.67,52.14 61.97,51.84 61.97,50.65 60.81,49.55 60.81,48 60.49,47.69 59.1,47.69 58.92,47.86 58.92,48.79 57.93,49.78 57.17,49.78 57.12,49.73 R46.1 | 55.93,49.8 56.03,49.7 | 55.93,49.8 R46.1 | 56.18,49.7 56.18,47.91 VT2.3
G_ON1  (via drill 0.35)
  Top 0.152: v46.81,39.26 48.1,39.26 v49.63,40.79
  Bottom 0.152: IC5.30 46.21,38.14 46.21,38.67 v46.81,39.26 | v49.63,40.79 51.18,40.79 52.38,39.58 53.44,39.58 55.18,41.33 55.18,41.94 55.55,42.31 56.03,42.31 R22.1 56.06,44.64 VT2.1
GND  (via drill 0.35)
  Top 0.152: v53.95,41.08 54.81,40.22 v55.06,40.22 | v57.03,28.75 59.87,31.58 v59.87,32.57
  Bottom 0.5: XP1.P$5 46.44,11.68 C1.2
  other vias: 65.79,46.87 64.06,46.5 58.76,46.63 57.28,48.11 74.42,41.33 79.1,41.2 47.79,24.93 45.69,21.47 44.46,20.36 48.4,16.3 20.66,14.94 19.67,12.72 22.39,12.84 19.06,15.06 65.91,23.94 67.88,23.82 67.51,29.74 65.79,28.38 61.47,37.13 60.86,34.79 60.86,17.53 62.83,14.2 35.83,17.41 28.18,20.98 35.09,21.6 33.11,23.57 14.74,19.5 18.81,21.97 20.66,33.93 21.4,36.89 25.59,42.93 28.8,44.9 28.67,46.38 14.99,17.53 10.18,35.16 9.93,37.01 54.44,44.16 50.62,44.53 51.61,38.24 52.72,38.24 9.44,16.79 9.56,23.45 9.56,29.98 27.69,10.25 64.68,10.38 67.14,8.28 69.86,8.77 76.02,8.78 80.58,13.83 74.17,16.91 87.86,31.83 90.69,24.31 82.43,32.82 25.47,14.82 28.55,15.19 35.46,33.56 28.43,29.74 25.84,17.65 52.22,16.29 39.4,9.02 29.66,5.08 76.27,28.13 34.35,18.64 78.36,28.99 79.72,34.28 73.06,41.31 74.54,36.99 57.42,40.81 30.44,25.66 5.43,23.32 9.86,28.62 18.98,10.01 25.88,10.26 26.37,12.85 48.55,19.38 58.53,23.56 60.5,18.88 65.79,15.56 70.23,18.51 40.4,25.67 47.79,25.92 45.07,11.61 43.1,16.42 43.23,10.01 41,8.04 45.7,30.23 44.22,30.47 52.23,32.44
  pour Top (rank 4, no thermals): -10.78,98.54 103.89,98.54 103.89,-7.01 -7.95,-7.01 -7.95,-2.69 -7.95,97.92 -10.78,97.92 -10.78,98.41
  pour Bottom (rank 4, no thermals): -5.23,94.22 -5.23,-2.69 98.71,-2.69 98.71,94.22
LED_A1  (via drill 0.35)
  Top 0.152: 59.53,8.55 59.84,8.55 63.8,4.59 70.81,4.59 71.34,4.06 74.01,4.06 74.39,3.68 LED98.A | 59.53,8.55 59.38,8.55 55.95,11.99 55.95,12.52 55.02,13.45 53.55,13.45 52.9,14.1 52.9,17.62 51.3,19.22 50.85,19.22 49.63,20.44 49.63,24.63 49.55,24.71 49.55,25.78 47.11,28.21 45.06,28.21 44.07,29.2 42.69,29.2 42.62,29.13 41.63,29.13 LED50.A 41.63,29.2 41.63,29.66 v41.09,30.19 | 59.53,8.55 v59.53,8.86 | LED82.A 46.73,11.37 48.33,9.77 48.33,9.09 50.31,7.11 51,7.11 52.63,8.74 54.88,8.74 56.64,6.98 v58.88,6.98 | 11.95,45.63 11.99,45.66 11.99,46.27 | 11.95,45.63 11.68,45.36 11.6,45.36 10.54,44.29 10.54,41.93 11.53,40.94 LED34.A | 11.99,46.27 11.68,46.58 11.68,47.87 LED18.A | 12.29,13.74 12.29,29.51 14.07,31.29 14.07,32.15 13.64,32.57 13.64,39.17 17.09,42.62 18.16,42.62 18.69,43.15 18.69,44.22 17.85,45.05 16.86,45.05 | 12.29,13.74 12.29,12.67 16.18,8.78 16.18,7.18 16.86,6.5 LED66.A | 16.86,45.05 12.52,45.05 11.95,45.63 | v20.6,53.66 21.28,54.35 21.28,55.42 21.05,55.65 21.05,65.25 21.36,65.55 21.36,69.29 23.64,71.57 23.87,71.57 LED2.A | v15.64,47.87 14.4,46.63 12.95,46.63 12.59,46.27 11.99,46.27 | 16.86,45.05 v16.86,44.67 | v24.1,21.43 25.24,22.57 25.24,27.15 25.62,27.53 27.07,27.53 27.42,27.18 27.42,26.31 28.18,25.54 28.79,25.54 v29.1,25.24 | v22.82,19.39 21.22,19.39 v15.49,13.66 | 12.29,13.74 v12.59,13.74
  Bottom 0.152: v59.53,8.86 59.53,7.63 v58.88,6.98 | v20.6,53.66 20.35,53.42 20.35,52.58 v15.64,47.87 | v16.86,44.67 17.47,44.06 17.47,42.62 19,41.09 19,39.87 IC2.15 | v24.1,21.43 24.1,21.03 22.82,19.76 v22.82,19.39 | v15.49,13.66 15.41,13.74 v12.59,13.74 | v41.09,30.19 40.39,29.49 37.67,29.49 37.06,28.88 36.07,28.88 35.87,29.09 33.39,29.09 32.01,27.71 30.72,27.71 30.15,27.15 30.15,26.3 v29.1,25.24
LED_A2  (via drill 0.35)
  Top 0.152: 24.52,4.78 25.4,3.91 32.64,3.91 v32.71,3.98 | 24.52,4.78 23.72,5.58 LED67.A | v34.77,1.92 36.45,1.92 37.89,3.37 39.72,3.37 42.69,6.34 42.69,7.03 LED83.A | LED99.A 70.35,2.53 69.21,3.68 67.92,3.68 67.08,2.84 67.08,1.7 66.49,1.1 64.39,1.1 63.8,1.7 63.5,1.7 63.27,1.92 63.27,4.21 59.53,7.94 58.75,7.94 58.22,7.42 57.41,7.42 53.69,11.13 53.19,11.13 52.52,11.81 52.52,13.36 48.49,17.39 47.38,17.39 46.88,17.88 46.39,17.88 45.84,18.43 v45.76,18.43 | LED51.A 40.03,33.47 38.88,32.33 37.6,32.33 36.76,33.17 36.76,34.66 35.83,35.6 34.91,35.6 34.85,35.65 33.73,35.65 v33.48,35.41 | v10.29,38.04 10.04,37.79 8.57,37.79 LED35.A | v17.24,48.1 18.16,49.02 18.16,51.45 17.47,52.14 16.63,52.14 15.26,50.77 15.26,50.31 LED19.A | v22.73,48.79 23.03,49.09 23.03,50.16 25.47,52.6 25.47,54.31 24.56,55.22 24.56,64.64 25.85,65.93 25.85,75.15 LED3.A | v24.18,4.44 24.52,4.78 | v19.99,22.3 19.99,18.61 16.48,15.11 14.73,15.11 14.42,14.8 14.42,13.28 16.71,10.99 20.63,10.99 v21.03,10.58 | v27.56,35.78 27.2,35.78 v26.07,34.65
  Bottom 0.152: v34.77,1.92 v32.71,3.98 31.86,4.84 31.86,6.71 32.16,7.01 34,7.01 34.36,7.37 39,7.37 42.53,10.9 42.53,13.69 43.02,14.18 43.02,15.04 44.95,16.98 44.95,17.63 v45.76,18.43 | 17.78,44.37 17.78,44.83 17.7,44.9 17.7,45.59 | 17.78,44.37 17.78,42.77 19.68,40.86 19.68,38.49 19.55,38.49 18.93,37.87 21.03,35.78 21.28,35.78 22.2,36.7 23.21,36.7 23.32,36.8 23.91,36.8 v26.07,34.65 26.25,34.46 26.25,27.53 27.1,26.68 27.1,25.59 26.93,25.42 26.49,25.42 25.96,24.89 25.96,24.43 25.84,24.31 21.25,24.31 19.99,23.04 v19.99,22.3 | 17.7,45.59 17.7,45.97 IC2.1 | v10.29,38.04 10.29,39.02 16.86,45.59 17.7,45.59 | 17.7,45.59 IC2.1 | v17.24,48.1 17.24,47.72 17.7,47.26 17.7,46.04 IC2.1 | v22.73,48.79 22.73,48.48 22.12,47.87 21.74,47.87 20.9,47.03 20.9,44.98 20.82,44.9 20.82,44.83 20.37,44.37 17.78,44.37 | v24.18,4.44 24.18,4.97 22.02,7.13 22.02,9.6 v21.03,10.58 | v27.56,35.78 33.11,35.78 v33.48,35.41
LED_A3  (via drill 0.35)
  Top 0.152: v32.71,6.28 32.65,6.34 28.52,6.34 LED68.A 28.44,6.34 27.07,4.97 25.85,4.97 24.25,6.57 22.94,6.57 21.32,8.19 v21.13,8.01 | v35.83,6.52 37.57,6.52 39.11,4.97 LED84.A | v65.79,1.71 65.79,2.01 66.16,2.38 LED100.A | v64.26,3.68 59.69,8.25 59.23,8.25 55.63,11.85 55.63,12.34 55.05,12.92 53.5,12.92 48.36,18.06 v48.52,18.22 | v8.25,34.16 7.72,34.69 7.03,34.69 6.19,33.85 5.28,33.85 LED36.A | v36.29,37.89 36.83,37.36 37.44,37.36 LED52.A | v21.89,38.27 16.4,38.27 15.93,38.74 v15.93,38.86 | v18.77,49.55 18.46,49.85 18.46,51.45 18.92,51.91 LED20.A | v22.2,71.04 22.2,71.34 23.34,72.49 23.34,73.86 24.1,74.62 24.1,75.84 24.63,76.37 24.63,76.75 26.39,78.51 28.14,78.51 LED4.A
  Bottom 0.152: v32.71,6.28 32.95,6.52 v35.83,6.52 36.14,6.82 38.91,6.82 42.83,10.75 42.83,13.45 43.32,13.93 43.32,14.87 46.54,18.09 48.4,18.09 v48.52,18.22 | v65.79,1.71 65.79,2.15 v64.26,3.68 | 7.65,36.83 7.64,36.82 7.64,34.77 v8.25,34.16 8.3,34.11 8.3,22.78 11.68,19.4 11.68,18.76 21.13,9.31 v21.13,8.01 | 17.74,48.52 19,47.26 19,46.04 IC2.2 | 17.74,48.52 17.55,48.71 16.94,48.71 16.63,48.41 16.63,47.49 16.14,47 15.36,47 7.65,39.29 7.65,36.83 | v21.89,38.27 22.63,37.53 27,37.53 27.02,37.51 35.33,37.51 35.7,37.89 v36.29,37.89 | v15.93,38.86 15.81,38.86 14.99,38.04 12.65,38.04 10.81,36.21 7.65,36.21 7.65,36.83 | 17.74,48.52 v18.77,49.55 18.69,49.55 18.69,50.39 21.83,53.53 21.83,69.38 22.2,69.74 v22.2,71.04
LED_A4  (via drill 0.35)
  Top 0.152: v37.28,74.09 37.28,75.61 33.55,79.34 32.59,79.34 31.11,80.82 31.11,81.32 LED5.A | v34.85,67.69 34.01,67.69 32.48,66.16 v32.48,64.87 | v25.24,58.01 25.55,58.01 26.08,57.47 26.08,52.75 25.1,51.77 25.1,50.3 25.13,50.27 | 25.13,50.27 23.03,48.18 22.12,48.18 v21.81,48.48 | v31.23,45.36 31.23,44.85 34.01,42.08 34.01,40.71 LED53.A | v27.38,49.02 26.39,49.02 25.13,50.27 | v36.14,2.53 36.14,2.61 35.3,3.45 LED85.A | v33.63,5.79 33.63,7.41 32.71,8.33 LED69.A | v59,2.38 60.6,2.38 60.98,2.76 62.12,2.76 LED101.A | v55.95,3.52 55.27,3.52 53.97,4.82 52.9,4.82 50.92,6.8 50.16,6.8 48.1,8.86 46.12,8.86 v42.24,4.97 | v39.45,6.39 39.92,6.39 40.64,7.11 41.09,7.11 42.47,8.48 42.46,8.48 42.46,9.11 42.11,9.47 41.48,9.47 39.7,11.24 39.7,11.69 v39.63,11.77 | v32.71,13.05 32.71,12.59 31.5,11.38 16.78,11.38 14.73,13.43 14.73,14.19 v15.03,14.5 | v11.07,18.92 11.13,18.98 11.13,24.05 5.75,29.43 3.83,29.43 LED37.A 3.76,29.43 1.77,31.41 1.77,32.48 1.55,32.71 1.55,33.62 1.93,34 1.93,34.84 2.54,35.45 2.54,38.12 4.44,40.02 4.44,41.85 6.04,43.45 6.04,43.61 13.51,51.07 14.96,51.07 15.19,51.3 15.34,51.3 16.48,52.45 18,52.45 18.61,53.05 19.99,53.05 20.52,52.52 LED21.A 20.52,52.45 20.52,51.99 19.76,51.23 v19.76,50.54
  Bottom 0.152: v34.85,67.69 37.28,70.12 v37.28,74.09 | v32.48,64.87 32.48,64.48 32.64,64.33 32.64,63.72 31.45,62.54 29.41,62.54 25.24,58.38 v25.24,58.01 | IC2.3 20.21,46.04 20.21,47.11 21.59,48.48 v21.81,48.48 21.74,48.48 19.76,50.46 v19.76,50.54 | v31.23,45.36 31.23,46.29 29.64,47.88 29.29,48.23 29.29,48.24 29.26,48.26 28.21,48.26 27.45,49.02 v27.38,49.02 | v36.14,2.53 36.14,4.13 36.1,4.17 36.53,4.6 | 36.53,4.6 35.35,5.79 v33.63,5.79 | v59,2.38 57.86,3.52 v55.95,3.52 | v42.24,4.97 42.16,5.05 39.45,5.05 | 39.45,5.05 36.98,5.05 36.53,4.6 | v39.45,6.39 39.45,5.05 | v39.63,11.77 38.27,13.13 35.99,13.13 34.77,14.35 33.02,14.35 32.71,14.04 v32.71,13.05 | v15.03,14.5 15.03,14.95 v11.07,18.92
LED_A5  (via drill 0.35)
  Top 0.152: 22.73,47.87 21.51,47.87 21.21,48.18 21.21,48.79 24.92,52.5 24.92,53.51 | 22.73,47.87 24.63,47.87 29.43,43.07 29.66,43.07 LED54.A | 24.92,53.51 24.92,53.91 23.34,55.49 22.65,55.49 LED22.A | v36.06,75.91 32.03,75.91 v31.95,75.99 | 24.92,53.51 v24.86,53.51 | 22.73,47.87 v22.73,47.57 | v30.12,0.93 29.82,1.24 27.83,1.24 27.61,1.47 25.35,1.47 21.03,1.92 18.24,2.91 17.78,3.37 17.78,3.52 15.57,5.73 15.57,8.48 11.68,12.36 11.68,24.33 6.35,29.66 6.35,31.03 3.37,34 3.15,34 LED38.A | v32.25,1.77 32.03,1.77 31.19,2.61 LED86.A | v35.53,12.67 36.29,11.91 36.29,11.37 LED70.A | v34.62,13.58 28.75,7.72 23.2,7.72 v22.75,8.17 | v55.19,7.03 55.19,6.57 56.1,5.66 56.71,5.66 58.01,4.36 58.01,3.91 LED102.A | v41.86,8.86 40.99,8.86 v38.84,11.02 | v21.51,42.54 21.51,39.57 22.65,38.42 22.65,35.37 23.25,34.78 23.25,33.78 21.38,31.91 21.38,30.82 23.96,28.25 v23.96,23.02 | v21.97,21.28 22.42,21.28 24.4,19.3 25.76,19.3 28.4,16.65 29.04,16.01 31.5,16.01 33.32,14.19 v33.32,13.74
  Bottom 0.152: v36.06,75.91 41.86,81.71 41.86,84.3 LED6.A | v31.95,75.99 30.29,74.33 27.78,74.33 27.23,73.78 27.23,73.17 27.68,72.71 27.68,71.88 27.99,71.57 27.99,65.32 27.68,65.02 27.68,62.58 24.56,59.46 24.56,53.82 v24.86,53.51 | v22.73,47.57 22.06,47.57 21.51,47.02 21.51,46.04 IC2.4 21.51,45.97 v21.51,42.54 | v32.25,1.77 30.96,1.77 v30.12,0.93 30.12,1.01 28.6,1.01 22.82,6.79 22.82,8.17 v22.75,8.17 | v41.86,8.86 41.86,8.82 47.82,8.82 | v38.84,11.02 38.32,11.53 38.32,12.15 37.64,12.82 35.61,12.82 35.53,12.74 v35.53,12.67 v34.62,13.58 34.46,13.74 v33.32,13.74 | v23.96,23.02 22.21,21.28 v21.97,21.28 | v55.19,7.03 54.81,7.41 53.93,7.41 52.53,8.82 47.82,8.82 | 47.82,8.82
LED_A6  (via drill 0.35)
  Top 0.152: LED55.A 25.09,44.14 25.09,44.04 24.15,44.04 23.26,43.15 v22.81,43.15 20.06,43.15 18.61,41.7 17.55,41.7 15.32,39.47 15.32,38.44 15.79,37.97 17.28,37.97 v18.63,36.62 | 24.22,57.97 24.25,57.93 24.25,56.79 v23.64,56.18 | 24.22,57.97 22.96,59.23 22.04,59.23 LED23.A | v23.11,62.96 24.25,61.82 24.25,58.01 24.22,57.97 | 39.3,13.01 39.34,13.05 39.34,15.03 LED71.A 39.42,15.11 39.95,15.64 v39.95,16.1 | 39.3,13.01 34.24,7.94 34.24,2.31 33.09,1.16 31.95,1.16 31.57,1.54 27.99,1.54 27.15,2.38 LED87.A | v11.68,25.7 11.99,26 11.99,31.34 5.51,37.81 4.21,37.81 LED39.A | v52.9,5.73 52.98,5.66 54.2,5.66 LED103.A | v43.58,11.47 41.84,11.47 40.56,12.74 39.57,12.74 39.3,13.01 | v22.38,33.85 22.38,33.61 20.91,32.13 20.91,30.62 23.03,28.5 23.03,25.91 22.74,25.62 20.37,25.62 20.06,25.93 17.49,25.93 14.9,23.34 14.9,21.81 v14.73,21.81 14.85,21.94 17.36,21.94 18.78,23.35 21.18,23.35 22.12,22.42 22.2,22.42 24.55,20.07 24.61,20.07 24.61,20.06 25.11,20.06 25.12,20.07 25.98,20.07 28.06,17.98 31.14,17.98 33.73,15.39 36.48,15.39 37.36,16.27 38.05,16.27 v38.17,16.15 | v47.13,15.05 47.58,15.05 48.09,14.53 49.25,14.53 51.07,12.71 51.07,11.97 v51.57,11.48
  Bottom 0.152: v22.81,43.15 22.81,45.97 IC2.5 22.81,46.04 22.81,46.73 23.34,47.26 23.34,47.42 23.95,48.03 23.95,55.87 v23.64,56.18 | v23.11,62.96 22.63,63.44 22.63,69.72 25.7,72.79 25.7,75 28.14,77.44 30.43,77.44 34.69,81.71 34.92,81.71 35.15,81.93 35.38,81.93 35.61,82.16 35.68,82.16 35.91,82.39 35.99,82.39 36.14,82.24 36.22,82.24 36.75,82.77 36.9,82.77 37.13,83 37.36,83 37.66,83.31 37.74,83.31 37.97,83.53 38.27,83.53 38.58,83.23 39.65,83.23 LED7.A | v11.68,25.7 11.38,25.39 11.38,23.95 13.51,21.81 v14.73,21.81 | v39.95,16.1 38.22,16.1 v38.17,16.15 | v18.63,36.62 19.25,36.62 22.01,33.85 v22.38,33.85 | v52.9,5.73 55.06,5.73 56,6.67 56,7.66 54.65,9.01 53.66,9.01 51.69,10.98 51.69,11.35 v51.57,11.48 | v43.58,11.47 43.58,11.96 44.07,12.45 44.07,12.47 46.64,15.05 v47.13,15.05
LED_A7  (via drill 0.35)
  Top 0.152: LED104.A 50.69,8.25 49.63,8.25 48.64,9.24 48.64,10.08 49.63,11.07 49.63,12.14 48.53,13.24 46.28,13.24 45.23,14.29 45.23,16.82 44.79,17.25 44.79,19.12 44.23,19.68 LED72.A 41.25,19.83 43.53,22.12 43.53,22.42 45.59,24.48 v46.5,24.48 | v11.7,38.16 11.7,38.86 9.93,40.63 9.93,42.08 7.64,44.37 7.26,44.37 6.35,43.45 6.35,41.62 LED40.A | 14.68,39.29 v14.68,38.83 | 14.68,39.29 17.4,42.01 18.46,42.01 20.44,43.99 20.44,44.22 LED56.A 20.52,44.29 20.9,44.67 20.9,45.21 | v21.96,2.63 22.17,2.84 22.73,2.84 LED88.A | v21.89,4.44 22.42,4.97 22.42,6.42 22.27,6.57 20.67,6.57 14.12,13.13 14.12,22.12 14.54,22.54 14.54,27.62 | 14.54,27.62 14.54,30.23 14.81,30.5 14.79,30.5 14.79,32.35 14.25,32.88 14.25,38.86 14.68,39.29 | 21.97,63.42 21.97,63.19 22.81,62.35 23.26,62.35 23.95,61.67 23.95,60.67 v23.64,60.37 | v22.5,51 22.47,51 20.9,49.43 20.9,45.21 | 21.97,63.42 v23.26,64.71 | 21.97,63.42 LED24.A | v24.2,47.08 23.33,47.08 21.46,45.21 20.9,45.21 | v27.96,30.83 26.52,30.83 26.04,31.31 22.69,31.31 v22.57,31.43 | v21.56,28.48 16.7,28.48 15.84,27.62 14.54,27.62
  Bottom 0.152: v11.7,38.16 11.94,38.41 14.25,38.41 v14.68,38.83 | v21.89,4.44 21.96,4.37 v21.96,2.63 | v23.64,60.37 22.35,59.07 22.35,51.15 v22.5,51 | v23.26,64.71 23.18,64.79 23.18,69.81 26.01,72.64 26.01,74.85 28.29,77.13 33.47,77.13 36.9,80.56 36.9,80.87 36.83,80.94 36.83,81.25 37.59,82.01 LED8.A | v24.2,47.08 24.06,46.95 IC2.6 | v46.5,24.48 45.21,24.48 44.88,24.8 44.88,24.83 44.09,25.62 41.78,25.62 40.85,24.69 39.81,24.69 39.57,24.45 39.57,23.37 37.43,21.23 37.43,20.73 37.18,20.49 36.17,20.49 36.01,20.64 34.56,20.64 33.07,22.13 30.24,22.13 29.04,23.32 29.04,23.95 28.44,24.56 28.44,27.38 27.57,28.25 27.57,30.44 v27.96,30.83 | v22.57,31.43 21.56,30.42 v21.56,28.48
LED_A8  (via drill 0.35)
  Top 0.152: v24.41,65.4 22.58,67.23 22.58,67.38 LED25.A | v34.39,80.49 34.13,80.49 32.91,81.71 v32.41,81.71 | v31.11,79.95 29.59,78.43 29.59,78.2 28.6,77.21 28.6,75.46 26.16,73.02 26.16,64.41 v25.47,63.72 | v9.62,44.06 8.78,44.9 LED41.A | v11.15,43.99 14.73,43.99 15.57,43.15 LED57.A | v7.34,34.08 6.65,33.4 6.65,29.81 11.99,24.48 11.99,12.52 15.87,8.63 15.87,5.89 17.78,3.98 18.69,3.98 LED89.A 18.77,4.06 19.99,5.28 v19.99,5.43 | v39.95,13.35 40.01,13.3 42.73,13.3 43.51,12.52 47.04,12.52 48.18,11.37 48.48,11.37 LED105.A | v37.13,13.89 36.83,13.58 35.53,13.58 34.92,14.19 34.31,14.19 34.04,13.93 | 34.04,13.93 34.01,13.89 34.01,13.43 29.72,9.14 20.41,9.14 v20.05,8.79 | v29.38,17.07 29.52,16.94 31.04,16.94 34.04,13.93 | LED73.A 41.93,24.1 41.09,23.26 41.02,23.26 40.64,22.88 40.64,21.51 39.82,20.69 37.75,20.69 37.31,20.24 37.31,19.21 36.75,18.66 36.75,17.53 36.68,17.45 36.68,16.49 36.19,16 34.21,16 30.53,19.68 27.95,19.68 26.82,20.81 26.82,21.84 27.71,22.73 28.1,22.73 28.66,23.3 28.66,23.8 28.52,23.95 27.17,23.95 26.09,22.86 26.09,20.49 27.75,18.82 29.77,18.82 v30,18.59 | v22.96,51.91 22.5,51.91 16.25,45.66 v12.82,45.66
  Bottom 0.152: v24.41,65.4 24.41,63.88 24.82,63.46 | 24.82,63.46 24.86,63.42 24.86,60.22 24.25,59.61 24.25,56.79 | 24.25,56.79 24.25,48.33 25.32,47.26 25.32,46.04 IC2.7 | v34.39,80.49 34.92,81.02 35.45,81.02 LED9.A | v32.41,81.71 32.41,81.25 v31.11,79.95 | v25.47,63.72 25.24,63.49 24.86,63.49 24.82,63.46 | v9.62,44.06 11.07,44.06 v11.15,43.99 | v39.95,13.35 39.87,13.43 37.59,13.43 v37.13,13.89 | v20.05,8.79 20.05,5.49 v19.99,5.43 | v30,18.59 29.38,17.98 v29.38,17.07 | 24.25,56.79 23.34,56.79 22.81,56.26 22.81,52.06 v22.96,51.91 | v11.15,43.99 v12.82,45.66 | v11.15,43.99 7.34,40.18 v7.34,34.08
LED_A9  (via drill 0.35)
  Top 0.152: v86.36,42.84 87.12,43.61 LED42.A | v77.91,44.37 77.59,44.37 76.98,43.76 LED26.A | v52.53,20.56 52.53,21.61 52.59,21.78 LED10.A | v58.67,13.51 60.12,14.95 61.59,14.95 64.18,17.55 66.47,17.55 68.14,19.22 68.14,19.83 v68.45,20.14 | v67.36,27.35 67.36,28.49 68.97,30.1 v68.97,35.15 | LED58.A 72.79,66.01 73.17,66.39 73.17,70.35 72.49,71.04 71.73,71.04 71.5,70.81 70.2,70.81 69.97,70.58 67.76,70.58 66.62,69.44 LED74.A 66.62,69.51 v65.71,70.43 | v46.66,61.21 46.96,60.9 46.96,54.58 46.43,54.05 46.05,54.05 44.98,52.98 44.98,52.67 44.67,52.37 44.67,51.38 42.69,49.4 41.55,49.4 LED90.A | v54.28,74.09 53.97,73.78 39.57,73.78 32.86,80.49 LED106.A | v65.71,45.28 67.23,45.28 69.29,47.34 69.29,55.8 68.3,56.79 68.3,61.44 67.76,61.97 67.76,62.43 66.39,63.8 65.78,63.8 64.18,65.4 64.18,68.37 64.49,68.68 64.49,71.11 v64.18,71.42 | v68.5,25.83 68.96,25.83 v81.71,38.58
  Bottom 0.152: v77.91,44.37 84.83,44.37 v86.36,42.84 86.13,43 v81.71,38.58 | v68.45,20.14 67.92,20.67 67.92,21.66 66.85,22.73 66.85,24.18 v68.5,25.83 67.36,26.98 v67.36,27.35 | 68.92,35.85 69.41,36.33 69.41,39.02 IC3.15 | 68.92,35.85 68.89,35.81 68.89,35.15 v68.97,35.15 | v46.66,61.21 46.66,61.97 54.28,69.59 54.28,71.34 | v54.28,74.09 54.28,71.34 | 64.45,71.69 63.8,72.33 57.71,72.33 56.71,71.34 54.28,71.34 | 64.45,71.69 v65.71,70.43 | v65.71,45.28 65.1,44.67 65.1,44.22 64.33,43.45 64.33,40.63 65.25,39.72 65.25,37.3 66.43,36.12 68.65,36.12 68.92,35.85 | 64.45,71.69 v64.18,71.42 | v52.53,20.56 52.53,20.19 51.61,19.27 51.61,15.43 53.53,13.51 v58.67,13.51
LED_A10  (via drill 0.35)
  Top 0.152: v31.42,69.89 33.78,69.89 35.45,68.22 35.45,65.86 39.87,61.44 39.87,58.92 39.8,58.85 39.8,55.04 40.33,54.5 40.33,53.82 39.87,53.36 39.87,52.9 38.5,51.53 38.5,49.63 40.48,47.64 44.67,47.64 45.28,48.25 46.05,48.25 LED91.A | v27.83,73.48 27.83,74.24 30.12,76.52 LED107.A | v68.14,66.16 68.75,66.16 70.74,64.18 70.74,62.96 71.8,61.89 72.95,61.89 LED59.A | v65.55,67.91 65.55,68.37 64.79,69.13 64.79,71.11 65.17,71.5 65.17,73.55 65.63,74.01 LED75.A 65.17,73.63 62.96,75.84 v60.52,75.84 | LED27.A 72.18,44.44 71.42,45.21 68.91,45.21 68.53,44.83 68.53,43.15 v68.6,43.07 68.98,43.07 72.79,39.26 72.79,36.14 73.25,35.68 74.55,35.68 76.07,37.21 v76.07,37.66 | LED11.A 54.25,14.88 v54.07,14.88 | v58.38,16.41 62.13,16.41 64.72,18.99 65.78,18.99 66.16,18.61 67.08,18.61 67.84,19.37 67.84,20.52 68.07,20.75 70.96,20.75 71.57,20.14 73.02,20.14 84.98,32.1 84.98,35.68 v84.68,35.99 | v87.35,38.65 87.73,38.65 89.33,40.25 LED43.A | v67.46,56.26 67.46,53.21 67.53,53.13 67.53,50.31 67.23,50.01 67.23,47.91 v68.06,47.08 | v37.21,77.97 37.21,77.51 37.36,77.36 59,77.36 v59.15,77.21
  Bottom 0.152: v27.83,73.48 28.86,72.45 | 28.86,72.45 v31.42,69.89 | v65.55,67.91 66.39,67.91 v68.14,66.16 68.07,66.16 68.07,65.7 64.79,62.43 64.79,60.22 67.46,57.55 v67.46,56.26 | v68.6,43.07 68.6,43.45 67.99,44.06 67.99,45.36 IC3.1 67.99,45.43 67.99,47.02 v68.06,47.08 | v58.38,16.41 v58.38,16.4 56.29,14.32 54.69,14.32 54.13,14.88 v54.07,14.88 | v87.35,38.65 v84.68,35.99 84.68,36.06 83.54,37.21 79.88,37.21 79.42,37.66 v76.07,37.66 | 28.86,72.45 31.8,75.38 32.64,75.38 35.23,77.97 v37.21,77.97 | v60.52,75.84 v59.15,77.21
LED_A11  (via drill 0.35)
  Top 0.152: v46.05,72.26 45.74,72.56 29.28,72.56 28.67,71.95 LED108.A | v50.54,76.75 58.24,76.75 v58.47,76.52 | LED76.A 63.42,78.28 62.05,78.28 59.61,75.84 v59.61,75.38 59.62,75.38 60.33,74.67 60.33,72.53 v63.88,68.98 | LED28.A 67.46,43.83 67.46,43.3 v68.6,42.16 68.53,42.16 68.22,41.85 65.93,41.85 65.78,41.69 64.12,41.69 63.42,40.99 62.86,40.99 v61.74,39.87 | v57.86,43.76 57.48,43.76 52.6,48.64 50.92,48.64 LED92.A | v69.21,56.79 69.82,56.18 70.74,56.18 72.26,57.7 72.64,57.7 LED60.A | v71.19,50.08 70.82,49.71 70.82,48.68 70.45,48.3 v70.51,48.24 | LED12.A 56.71,13.28 57.25,13.28 58.09,12.44 63.39,12.44 64.31,13.35 68.07,13.35 77.06,22.35 77.97,22.35 78.28,22.65 78.28,24.02 90.7,36.44 91.08,36.44 LED44.A 90.55,36.37 v89.18,37.74 | v63.65,63.34 63.65,60.9 64.11,60.45 64.11,59.68 v62.89,58.46 | v68.14,53.21 68.68,53.74 68.68,54.96 v68.37,55.26
  Bottom 0.152: v50.54,76.75 v46.05,72.26 | v59.61,75.38 v58.47,76.52 | 69.17,42.73 69.21,42.77 69.21,44.22 69.29,44.29 69.29,45.36 IC3.2 69.29,45.43 69.29,47.02 v70.51,48.24 | 69.17,42.73 v68.6,42.16 | v61.74,39.87 v57.86,43.76 | 69.21,55.26 69.21,53.97 71.42,51.76 71.42,50.84 71.19,50.62 v71.19,50.08 | 69.21,55.26 v69.21,56.79 | v89.18,37.74 87.65,39.26 83.31,39.26 81.56,37.51 80.03,37.51 79.04,38.5 79.04,38.96 77.46,40.54 76.68,40.54 76.14,41.08 76.14,41.85 75.31,42.69 69.21,42.69 69.17,42.73 | v63.88,68.98 63.88,68.52 64.18,68.22 64.18,66.77 63.34,65.93 63.34,63.65 v63.65,63.34 | v62.89,58.46 63.34,58.46 68.14,53.66 v68.14,53.21 | 69.21,55.26 v68.37,55.26
LED_A12  (via drill 0.35)
  Top 0.152: v65.48,5.2 65.17,4.9 63.95,4.9 60.14,8.71 60.14,9.85 LED13.A | v67,3.68 67.31,3.98 70.51,3.98 71.57,2.92 71.57,2.31 71.88,2 74.54,2 76.61,3 78.89,5.28 78.89,15.18 86.32,22.61 | 86.32,22.61 92.83,29.13 92.83,31.72 92.15,32.4 LED45.A | v63.04,43.44 63.04,42.08 LED29.A | v62.58,45.89 62.28,45.59 59.69,45.59 59.08,44.98 57.55,44.98 55.42,47.11 55.42,50.08 LED93.A | v70.74,46.96 70.28,46.96 69.9,47.34 69.9,53.66 72.11,55.87 72.26,55.87 LED61.A 72.34,55.95 72.87,55.95 73.94,57.02 73.94,58.08 73.02,59 72.18,59 71.65,59.53 71.65,61.59 68.6,64.64 v68.6,65.32 | v30.27,71.95 30.27,70.58 30.04,70.35 30.04,68.14 29.21,67.3 28.06,67.3 LED109.A | v31.34,73.48 31.64,73.17 56.49,73.17 56.52,73.21 | 56.52,73.21 60.98,77.67 60.98,79.27 60.37,79.88 60.37,81.93 LED77.A | v59.31,71.72 58.01,71.72 56.52,73.21 | v62.89,48.33 62.89,47.87 62.4,47.39 61.54,47.39 61.06,47.87 v61.06,50.77 | 86.32,22.61 86.51,22.42 v86.58,22.42 | v73.48,36.37 73.1,36.75 73.1,39.41 70.66,41.85 v70.66,43.45
  Bottom 0.152: v67,3.68 v65.48,5.2 | v63.04,43.44 63.04,45.43 v62.58,45.89 62.28,46.2 62.28,47.26 62.89,47.87 v62.89,48.33 | v70.74,46.96 70.43,46.65 70.43,46.58 70.51,46.5 70.51,45.43 IC3.3 70.51,45.36 70.51,44.14 70.66,43.99 v70.66,43.45 | v30.27,71.95 30.27,72.32 31.34,73.39 v31.34,73.48 | v68.6,65.32 68.91,65.63 68.91,66.31 67,68.22 66.16,68.22 62.35,72.03 59.61,72.03 v59.31,71.72 56.94,69.36 56.94,65.86 58.31,62.9 58.31,55.26 59.36,54.37 60.84,52.41 61.16,51.84 61.21,51.73 61.5,51.21 v61.06,50.77 | v86.58,22.42 86.58,23.34 75.92,34 75.46,34 73.48,35.99 v73.48,36.37
LED_A13  (via drill 0.35)
  Top 0.152: v64.94,6.8 64.41,7.33 63.88,7.33 LED14.A | v71.19,12.67 75.92,12.67 92,28.75 92,29.74 90.55,31.19 90.39,31.19 LED46.A 90.62,31.19 90.62,32.48 90.68,32.54 v90.68,32.85 | v59.76,42.92 59.46,42.62 59.46,39.52 LED30.A | v74.09,49.93 73.86,50.16 73.86,52.52 LED62.A | v72.72,48.56 72.72,47.57 v72.11,46.96 72.18,46.96 73.02,46.12 74.7,46.12 75.23,46.65 77.21,46.65 78.58,45.28 79.43,45.28 v79.49,45.22 | v32.41,73.78 32.71,73.48 56.33,73.48 60.68,77.82 60.68,79.12 60.07,79.72 60.07,81.02 59.31,81.78 59.31,82.09 60.3,83.08 63.27,83.08 64.87,81.48 64.87,80.49 LED78.A 64.94,80.41 66.09,80.41 71.42,75.08 71.42,72.56 73.48,70.5 73.48,69.13 74.55,68.07 74.55,56.71 73.4,55.57 73.4,54.58 v73.78,54.2 | LED110.A 28.9,62.43 30.81,64.33 30.81,66.08 30.35,66.54 30.35,70.2 30.58,70.43 30.58,71.34 v31.19,71.95 31.49,72.26 34.54,72.26 38.66,68.14 38.66,67.76 38.5,67.61 38.5,67 38.2,66.69 38.2,65.93 39.19,64.94 39.95,64.94 40.24,64.94 v40.69,65.4 | v55.72,55.34 55.72,54.96 58.09,52.6 59.53,52.6 LED94.A 59.61,52.6 59.61,51.68 58.88,50.95 57.84,50.14 56.54,48.85 56.54,47.03 57.71,45.87 v57.71,45.74 | v55.65,57.25 55.19,57.25 53.82,58.62 49.32,58.62 v48.48,59.46
  Bottom 0.152: v64.94,6.8 64.94,7.26 69.21,11.53 70.05,11.53 v71.19,12.67 | v59.76,42.92 57.71,44.98 v57.71,45.74 | v72.72,48.56 v74.09,49.93 74.01,49.93 74.01,53.82 73.78,54.05 v73.78,54.2 | v72.11,46.96 71.8,46.65 71.8,45.43 IC3.4 | v31.19,71.95 31.19,72.41 32.41,73.63 v32.41,73.78 | v55.72,55.34 56.1,55.72 56.1,56.79 v55.65,57.25 | v48.48,59.46 47.34,60.6 46.35,60.6 42.85,64.1 42.85,64.48 42.33,65 40.75,65.42 v40.69,65.4 | v90.68,32.85 90.68,38.14 86.97,41.85 86.97,43.15 85.44,44.67 80.04,44.67 v79.49,45.22
LED_A14  (via drill 0.35)
  Top 0.152: v33.7,64.71 32.33,63.34 32.33,60.07 30.58,58.31 LED111.A | v40.18,66.62 40.43,66.62 40.79,66.26 42.35,66.26 48.66,72.56 54.89,72.56 v55.19,72.26 | v65.55,77.21 65.86,76.91 67.08,76.91 67.53,77.36 LED79.A | v76.83,52.6 77.36,52.06 77.36,51.38 LED63.A | v66.93,52.83 64.83,54.92 | 64.83,54.92 63.65,56.1 62.89,56.1 LED95.A | v68.3,12.44 68.3,6.04 LED15.A | v67.61,14.27 68.07,14.27 85.63,31.83 | 85.63,31.83 88.34,34.54 88.34,35.53 LED47.A | v57.11,35.09 56.99,35.22 56.99,35.34 56.55,35.77 LED31.A | v81.02,46.04 81.02,44.3 82.39,42.93 82.39,41.4 82.01,41.02 82.01,40.56 83.08,39.49 84.3,39.49 85.44,40.63 86.13,40.63 86.43,40.33 86.43,38.65 85.59,37.81 85.59,31.87 85.63,31.83 | v67.15,62.12 67.15,59.53 65.48,57.86 65.48,55.57 64.83,54.92